# EAGLE design MotorController (EAGLE 6.5.0)
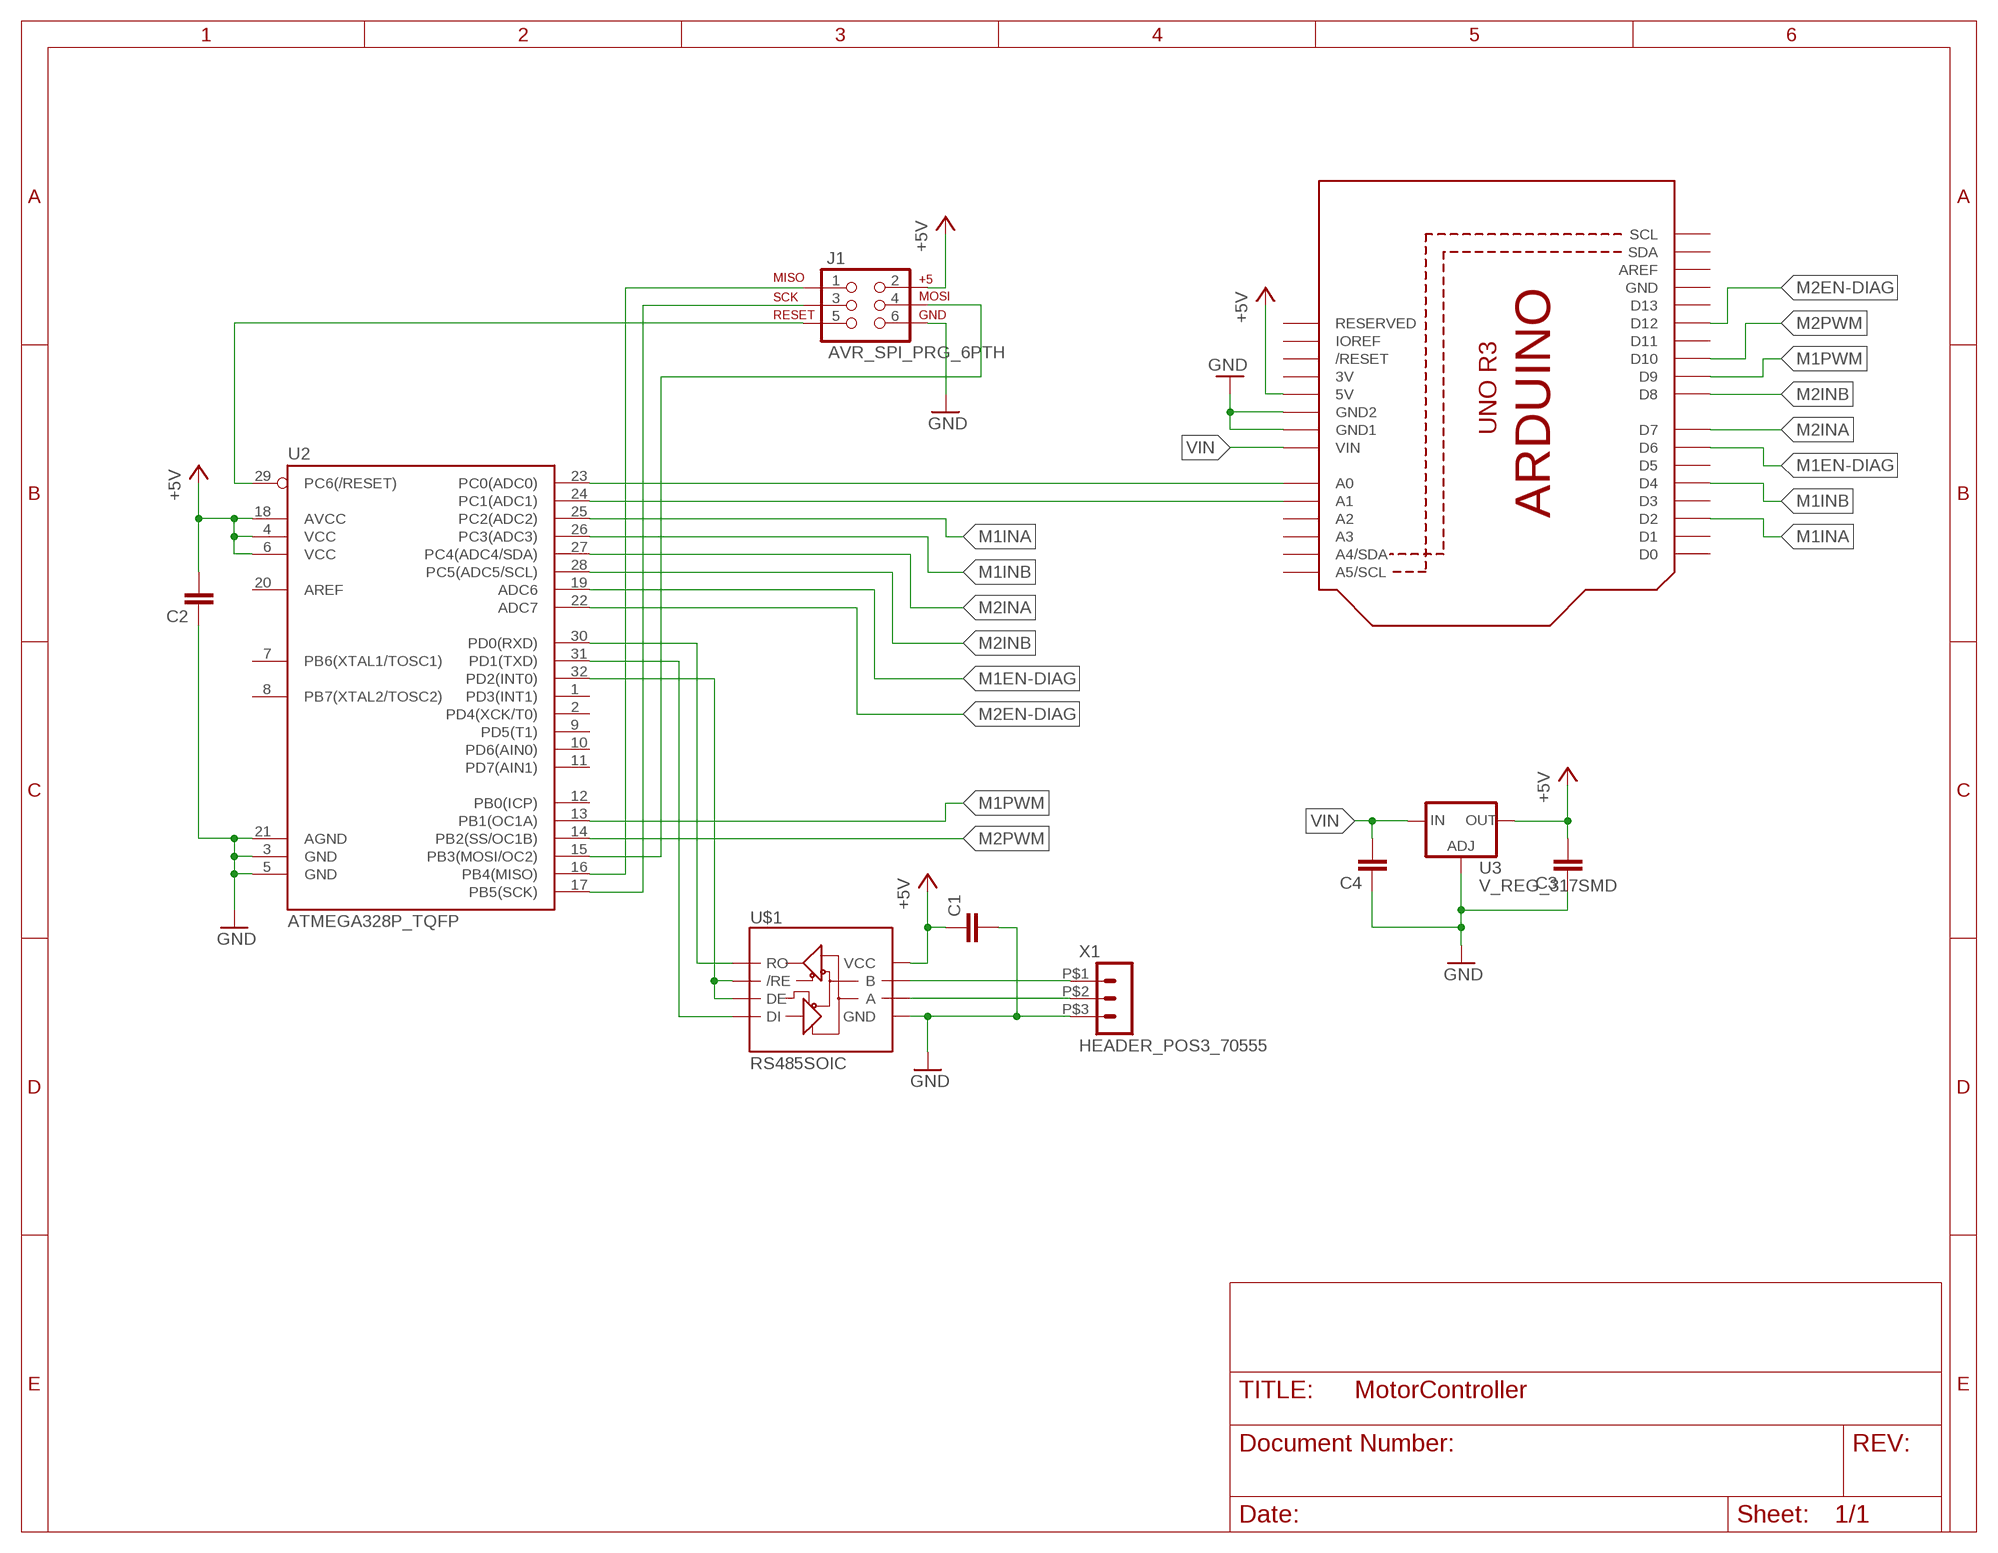
[diagram p0: schematic, sheet 1]

## Parts
C1  C-EUC0603  [C0603]
C2  C-EUC0603  [C0603]
C3  C-EUC1206  [C1206]
C4  C-EUC1206  [C1206]
J1  AVR_SPI_PRG_6PTH  [2X3]
U1  ARDUINOR3-BPLACE  [ARDUINOR3-BPLACE]
U2  ATMEGA328P_TQFP  [TQFP32-08]
U3  V_REG_317SMD  [SOT223]
U$1  RS485SOIC  [SO08]
X1  HEADER_POS3_70555  [70555-POS3]

## Nets
+5V: C1.1 C2.2 C3.2 J1.2 U1.5V U2.4(VCC) U2.6(VCC) U2.18(AVCC) U3.2(OUT) U$1.8(VCC)
GND: C1.2 C2.1 C3.1 C4.1 J1.6 U1.GND1 U1.GND2 U2.3(GND) U2.5(GND) U2.21(AGND) U3.1(ADJ) U$1.5(GND) X1.P$3
M1EN-DIAG: U1.D6 U2.19(ADC6)
M1INA: U1.D2 U2.25(PC2(ADC2))
M1INB: U1.D4 U2.26(PC3(ADC3))
M1PWM: U1.D9 U2.13(PB1(OC1A))
M2EN-DIAG: U1.D12 U2.22(ADC7)
M2INA: U1.D7 U2.27(PC4(ADC4/SDA))
M2INB: U1.D8 U2.28(PC5(ADC5/SCL))
M2PWM: U1.D10 U2.14(PB2(SS/OC1B))
N$1: J1.5 U2.29(PC6(/RESET))
N$2: J1.3 U2.17(PB5(SCK))
N$3: J1.1 U2.16(PB4(MISO))
N$4: J1.4 U2.15(PB3(MOSI/OC2))
N$5: U2.32(PD2(INT0)) U$1.2(/RE) U$1.3(DE)
N$6: U2.30(PD0(RXD)) U$1.1(RO)
N$7: U2.31(PD1(TXD)) U$1.4(DI)
N$8: U1.A0 U2.23(PC0(ADC0))
N$9: U1.A1 U2.24(PC1(ADC1))
N$10: U$1.7(B) X1.P$1
N$11: U$1.6(A) X1.P$2
VIN: C4.2 U1.VIN U3.3(IN)
Unconnected: U1.A2 U1.A3 U1.A4(A4/SDA) U1.A5(A5/SCL) U1.AREF U1.D0 U1.D1 U1.D3 U1.D5 U1.D11 U1.D13 U1.IOREF U1.RESERVED U1.RESET(/RESET) U1.SCL U1.SDA U2.1(PD3(INT1)) U2.2(PD4(XCK/T0)) U2.7(PB6(XTAL1/TOSC1)) U2.8(PB7(XTAL2/TOSC2)) U2.9(PD5(T1)) U2.10(PD6(AIN0)) U2.11(PD7(AIN1)) U2.12(PB0(ICP)) U2.20(AREF)

## Power pins joined to a net without a drawn wire
3V: U1.3V
GND: U1.GND

## Library data of the parts
C1-C4 = resistor:C-EU: CAPACITOR, European symbol
J1 = SparkFun-Connectors:AVR_SPI_PRG_6: AVR ISP 6 Pin This is the reduced ISP connector for AVR programming. Common on Arduino. This footprint will take up less PCB space and can be used with a 10-pin to 6-pin adapter such as SKU: BOB-08508 **Special note about "TEST_POINT" package. The stop mask is on the top side, so if you want your programming test points to be on the bottom of your board, make sure to place this package on the bottom side of the board. This also ensure that the orientation to program from the bottom side will be correct.
U1 = adafruit:ARDUINOR3: This is a new object for the new Arduino R3 - with extra pins that you may want to use (such as IOref, and duplicated A4/A5
U2 = SparkFun-DigitalIC:ATMEGA328P_TQFP; PROD_ID: IC-09069
U3 = SparkFun-PowerIC:V_REG_317: Voltage Regulator Standard LM317 adjustable voltage regulator. AOI (Adjust Output Input). Google 'LM317 Calculator' for easy to use app to get the two resistor values needed. 240/720 for 5V output. 240/390 for 3.3V output. Spark Fun Electronics SKU : COM-00527
U$1 = SparkFun-DigitalIC:RS485: RS485 transceiver
X1 = con-molex-c-grid-sl:HEADER_POS3_?: Molex -C-Grid® / SL Series connector Wire-to-Board 2.54 mm (0.100") pitch header, 3 positions.

## Board
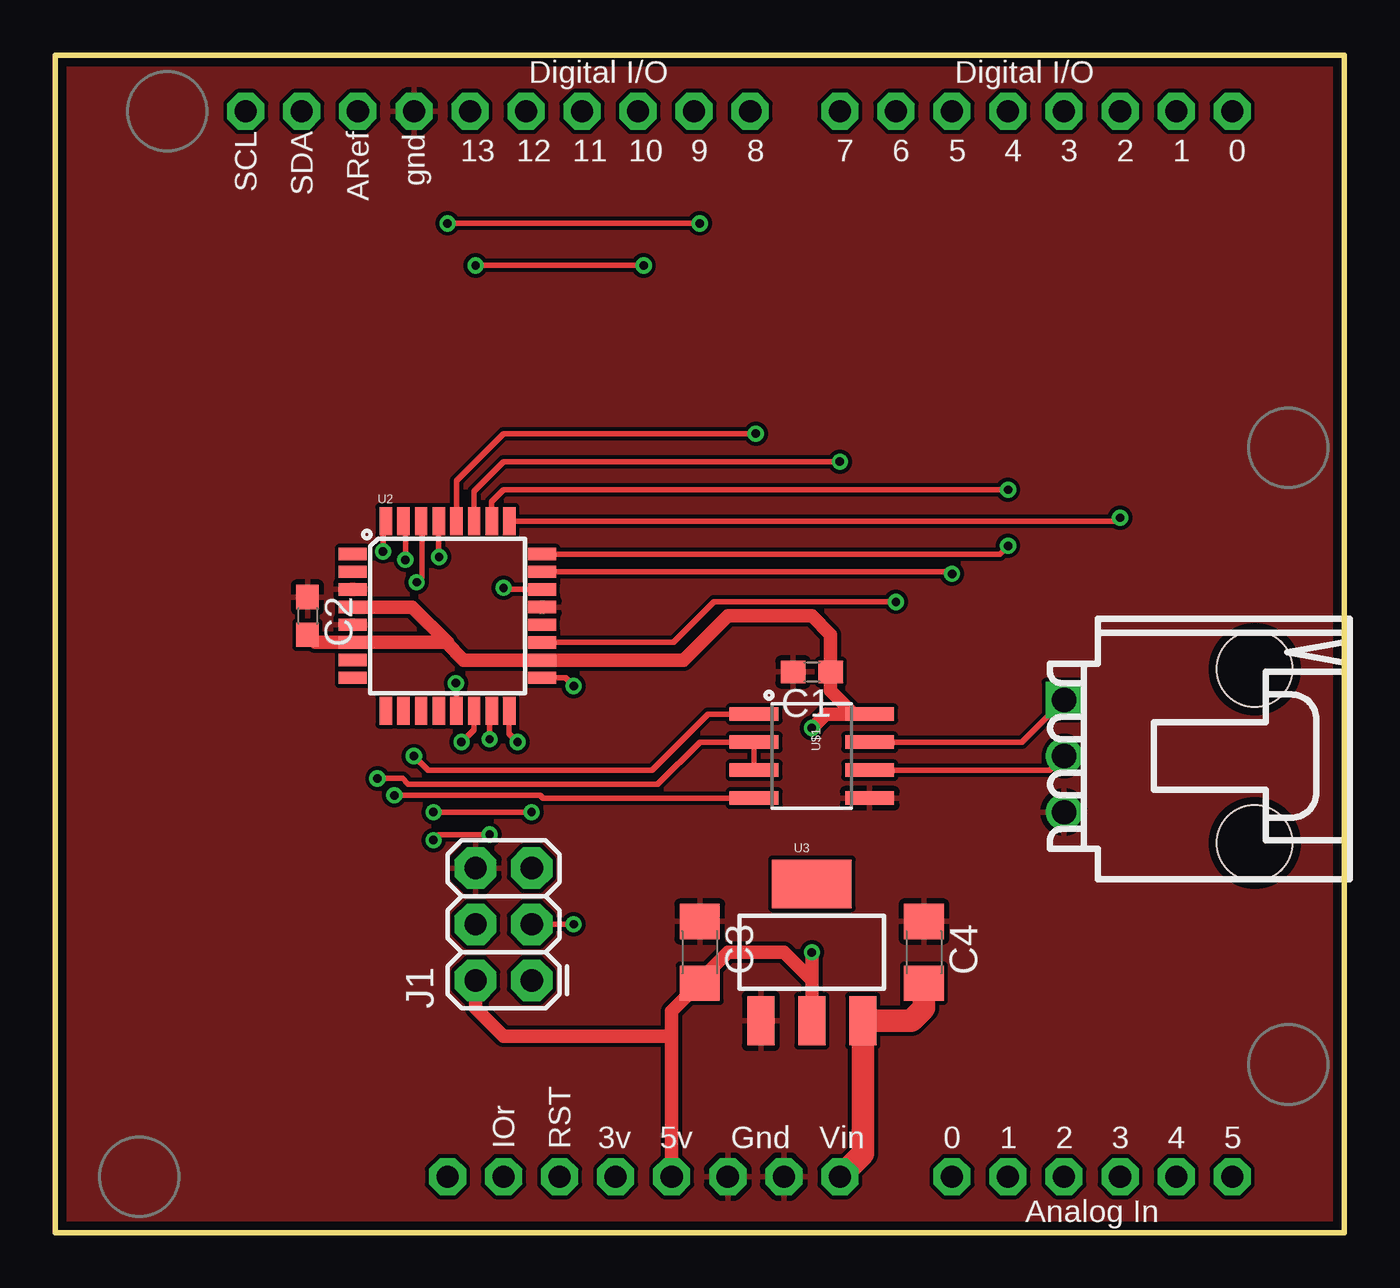
[diagram p1: board, top side]
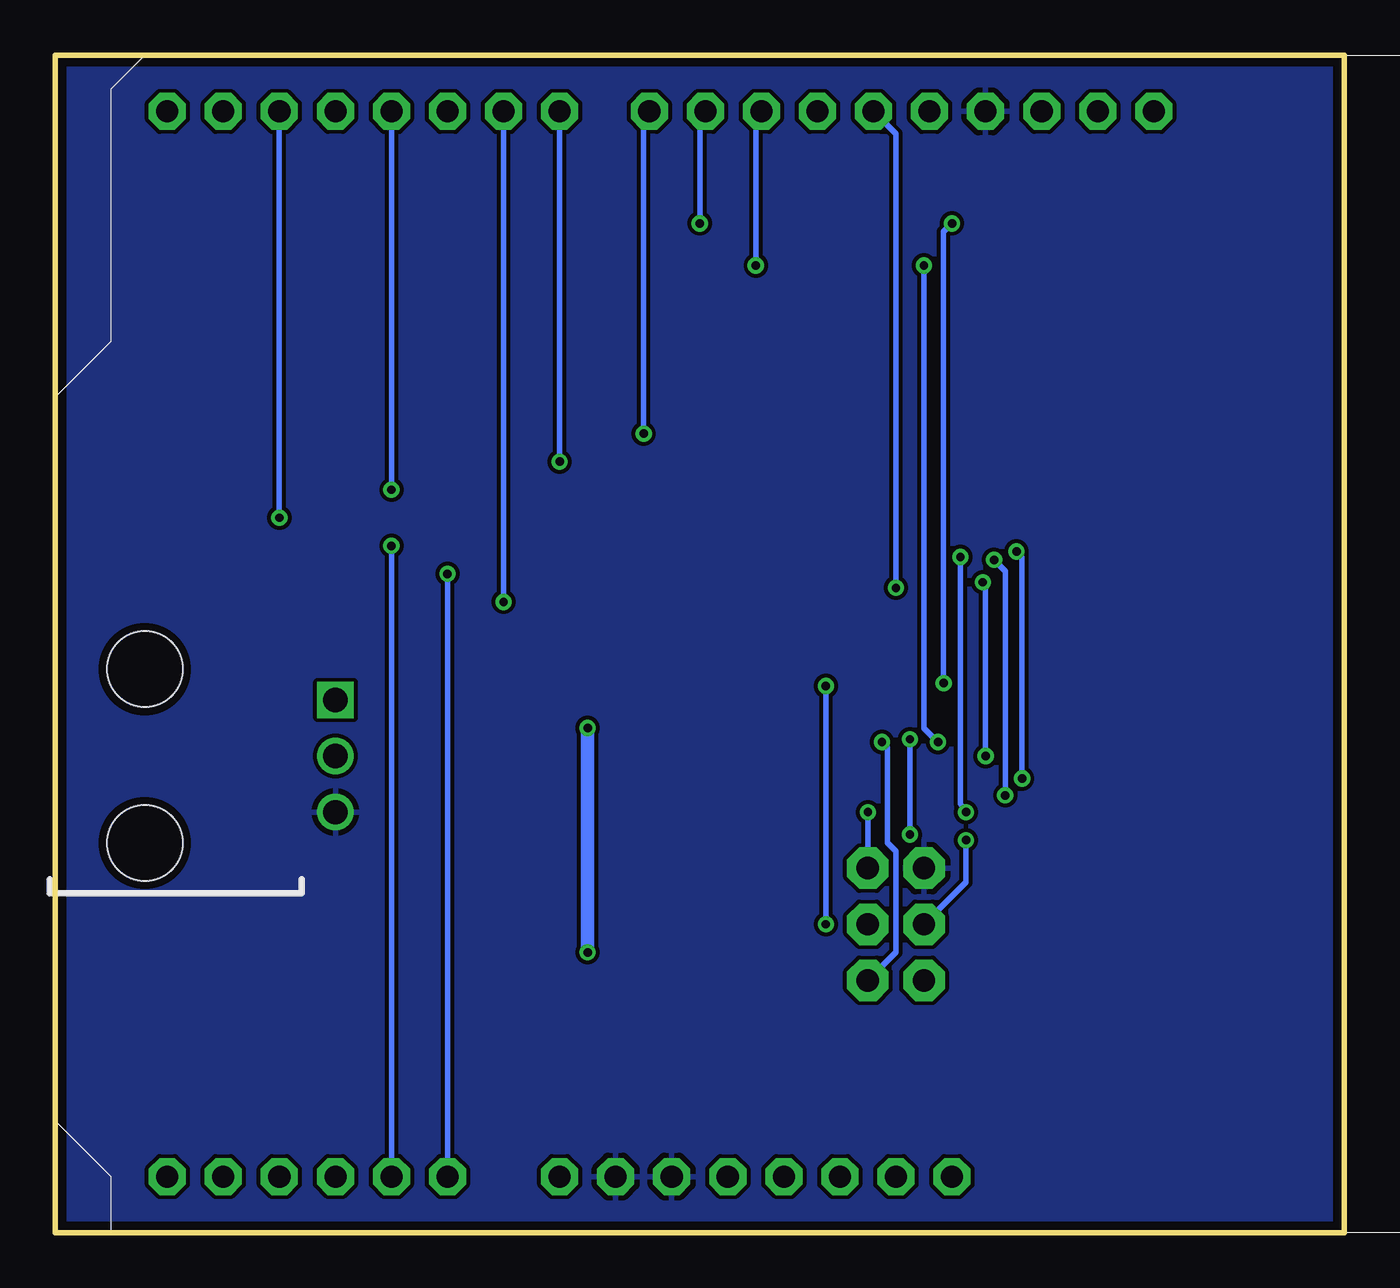
[diagram p2: board, bottom side, seen from below]

Size 58.42 x 53.34 mm. Coordinates in mm from the lower left corner, seen from the top.
Outline: 0,0 58.42,0 58.42,53.34 0,53.34 0,0
Copper layers (1*16): Top 0.0356mm / dielectric 1.5011mm / Bottom 0.0356mm
Design rules "GoldPhoenixCheap": minimum track width 7mil, minimum drill 15mil, track to track 7mil, track to pad 7mil, pad to pad 7mil, via to via 7mil, smd to smd 6mil, copper to edge 15mil, drill to drill 6mil, minimum pad ring 7mil, minimum via ring 7mil, stop-mask expansion 4mil, vias tented up to drill 15mil, thermal gap 10mil

### Footprints (pad centres in the part's own frame; a part is rotated, then mirrored left to right if it is on the bottom)
C0603 = smd 1.1 x 1: 1 -0.85,0; 2 0.85,0
C1206 = smd 1.6 x 1.8: 1 -1.4,0; 2 1.4,0
2X3 = drill 1.016 pad 1.88 octagon: 1 0,0; 2 0,2.54; 3 2.54,0; 4 2.54,2.54; 5 5.08,0; 6 5.08,2.54
ARDUINOR3-BPLACE = drill 1 pad 1.676 octagon: 3V 35.56,2.54; 5V 38.1,2.54; A0 50.8,2.54; A1 53.34,2.54; A2 55.88,2.54; A3 58.42,2.54; A4 60.96,2.54; A5 63.5,2.54; AREF 23.876,50.8; D0 63.5,50.8; D1 60.96,50.8; D2 58.42,50.8; D3 55.88,50.8; D4 53.34,50.8; D5 50.8,50.8; D6 48.26,50.8; D7 45.72,50.8; D8 41.656,50.8; D9 39.116,50.8; D10 36.576,50.8; D11 34.036,50.8; D12 31.496,50.8; D13 28.956,50.8; GND 26.416,50.8; GND1 43.18,2.54; GND2 40.64,2.54; IOREF 30.48,2.54; RESERVED 27.94,2.54; RESET 33.02,2.54; SCL 18.796,50.8; SDA 21.336,50.8; VIN 45.72,2.54
TQFP32-08 = smd 1.27 x 0.559: 1 -4.293,2.8; 2 -4.293,2; 3 -4.293,1.2; 4 -4.293,0.4; 5 -4.293,-0.4; 6 -4.293,-1.2; 7 -4.293,-2; 8 -4.293,-2.8; 17 4.293,-2.8; 18 4.293,-2; 19 4.293,-1.2; 20 4.293,-0.4; 21 4.293,0.4; 22 4.293,1.2; 23 4.293,2; 24 4.293,2.8 | smd 0.559 x 1.27: 9 -2.8,-4.293; 10 -2,-4.293; 11 -1.2,-4.293; 12 -0.4,-4.293; 13 0.4,-4.293; 14 1.2,-4.293; 15 2,-4.293; 16 2.8,-4.293; 25 2.8,4.293; 26 2,4.293; 27 1.2,4.293; 28 0.4,4.293; 29 -0.4,4.293; 30 -1.2,4.293; 31 -2,4.293; 32 -2.8,4.293
SOT223 = smd 1.219 x 2.235: 1 -2.311,-3.099; 2 0,-3.099; 3 2.311,-3.099 | smd 3.6 x 2.2: 4 0,3.099
SO08 = smd 0.61 x 2.21: 1 -1.905,-2.616; 2 -0.635,-2.616; 3 0.635,-2.616; 4 1.905,-2.616; 5 1.905,2.616; 6 0.635,2.616; 7 -0.635,2.616; 8 -1.905,2.616
70555-POS3 = drill 1.1 square: P$1 -2.54,0 | drill 1.1: P$2 0,0; P$3 2.54,0 | hole 3.404: -3.937,8.636; 3.937,8.636

### Placement (x,y rotation side)
C1  34.29,25.4 180 top
C2  11.43,27.94 270 top
C3  29.21,12.7 270 top
C4  39.37,12.7 270 top
J1  21.59,11.43 90 top
U1  -10.16,0 0 top
U2  17.78,27.94 0 top
U3  34.29,12.7 0 top
U$1  34.29,21.59 270 top
X1  45.72,21.59 270 top

### Tracks (layer width: path | path; a pad name or v marks a point on that pad's centre or on a via)
+5V  (via drill 0.38)
  Top 0.61: U1.5V 27.94,8.89 | 27.94,8.89 27.94,10.03 C3.2 29.21,11.43 30.48,12.7 33.02,12.7 34.29,11.43 | J1.2 19.05,10.16 20.32,8.89 27.94,8.89 | U3.2 34.29,11.43 | U$1.8 36.2,23.5 | 36.2,23.5 35.14,24.55 C1.1 35.14,27.09 34.29,27.94 30.48,27.94 28.48,25.94 U2.18 18.51,25.94 17.71,26.74 | U2.6 11.78,26.74 C2.2 | U2.6 17.71,26.74 | 17.71,26.74 17.78,26.74 16.18,28.34 U2.4 | U2.6 15.31,26.74 | 36.2,23.5 34.92,23.5 v34.29,22.86 | v34.29,12.7 34.29,11.43
  Bottom 0.61: v34.29,22.86 v34.29,12.7
GND
  pour Top: 0,0 58.42,0 58.42,53.34 0,53.34
  pour Bottom: 0,0 58.42,0 58.42,53.34 0,53.34
M1EN-DIAG  (via drill 0.38)
  Top 0.254: U2.19 28.01,26.74 29.84,28.57 v38.1,28.57
  Bottom 0.254: v38.1,28.57 U1.D6
M1INA  (via drill 0.38)
  Top 0.254: U2.25 48.11,32.23 v48.26,32.38
  Bottom 0.254: v48.26,32.38 U1.D2
M1INB  (via drill 0.38)
  Top 0.254: U2.26 19.78,33.12 20.32,33.66 v43.18,33.66
  Bottom 0.254: v43.18,33.66 U1.D4
M1PWM  (via drill 0.38)
  Top 0.254: U2.13 18.18,24.87 v18.16,24.89 | v17.78,45.72 v29.21,45.72
  Bottom 0.254: v18.16,24.89 18.16,45.34 v17.78,45.72 | v29.21,45.72 29.21,50.55 U1.D9
M2EN-DIAG  (via drill 0.38)
  Top 0.254: U2.22 20.39,29.14 v20.32,29.21
  Bottom 0.254: v20.32,29.21 20.32,49.78 U1.D12
M2INA  (via drill 0.38)
  Top 0.254: U2.27 18.98,33.59 20.32,34.92 v35.56,34.92
  Bottom 0.254: v35.56,34.92 U1.D7
M2INB  (via drill 0.38)
  Top 0.254: U2.28 18.18,34.05 20.32,36.2 v31.75,36.2
  Bottom 0.254: v31.75,36.2 31.75,50.55 U1.D8
M2PWM  (via drill 0.38)
  Top 0.254: U2.14 18.98,22.79 v18.41,22.23 | v19.05,43.81 v26.67,43.81
  Bottom 0.254: v18.41,22.23 19.05,22.86 v19.05,43.81 | v26.67,43.81 26.67,50.55 U1.D10
N$1  (via drill 0.38)
  Top 0.254: U2.29 17.38,30.63 v17.4,30.61 | v17.14,19.05 v21.59,19.05
  Bottom 0.254: v17.4,30.61 17.4,19.43 v17.14,19.05 | v21.59,19.05 J1.5
N$2  (via drill 0.38)
  Top 0.254: J1.3 v23.5,13.97 | U2.17 23.12,25.14 v23.5,24.77
  Bottom 0.254: v23.5,13.97 v23.5,24.77
N$3  (via drill 0.38)
  Top 0.254: U2.16 20.58,22.6 v20.95,22.23
  Bottom 0.254: v20.95,22.23 20.7,21.97 20.7,17.65 20.32,17.27 20.32,12.7 J1.1
N$4  (via drill 0.38)
  Top 0.254: v17.14,17.78 17.4,18.03 v19.68,18.03 | v19.68,22.35 19.68,23.55 U2.15
  Bottom 0.254: J1.4 17.14,15.88 v17.14,17.78 | v19.68,18.03 v19.68,22.35
N$5  (via drill 0.38)
  Top 0.254: U$1.3 U$1.2 29.21,22.23 27.3,20.32 16,20.32 15.75,20.57 v14.61,20.57 | v14.86,30.86 14.86,32.11 U2.32
  Bottom 0.254: v14.61,20.57 14.61,30.61 v14.86,30.86
N$6  (via drill 0.38)
  Top 0.254: U$1.1 29.59,23.5 27.05,20.95 16.89,20.95 v16.26,21.59 | v16.38,29.46 16.64,29.72 16.64,32.18 U2.30
  Bottom 0.254: v16.26,21.59 16.26,29.34 v16.38,29.46
N$7  (via drill 0.38)
  Top 0.254: U$1.4 22.1,19.68 21.97,19.81 v15.37,19.81 | v15.88,30.48 15.88,32.14 U2.31
  Bottom 0.254: v15.37,19.81 15.37,29.97 v15.88,30.48
N$8  (via drill 0.38)
  Top 0.254: U2.23 40.55,29.94 v40.64,29.84
  Bottom 0.254: v40.64,29.84 U1.A0
N$9  (via drill 0.38)
  Top 0.254: U2.24 42.8,30.74 v43.18,31.11
  Bottom 0.254: v43.18,31.11 U1.A1
N$10
  Top 0.254: U$1.7 43.81,22.23 X1.P$1
N$11
  Top 0.254: U$1.6 45.09,20.95 X1.P$2
VIN
  Top 1.016: U1.VIN 36.6,3.58 U3.3 38.81,9.6 39.37,10.16 C4.2